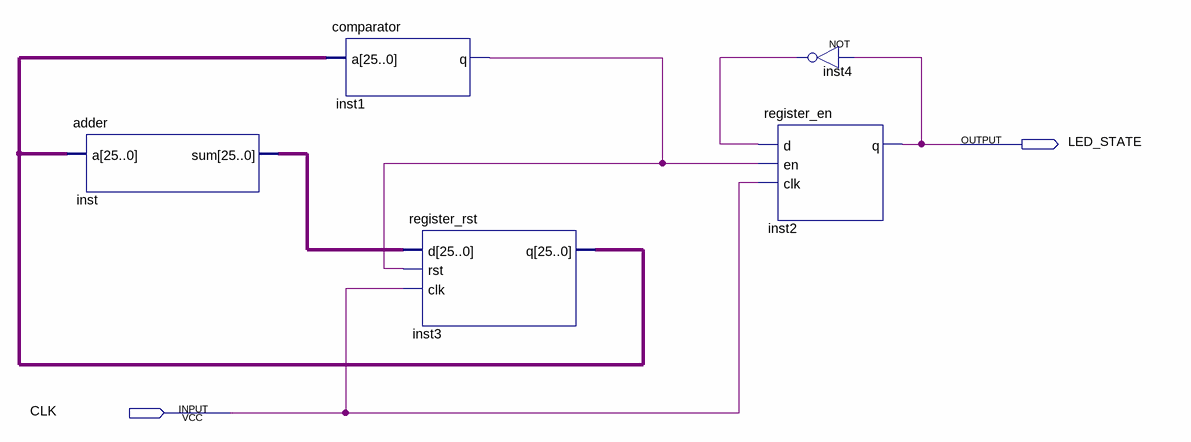
[diagram p0: schematic sheet]
// Quartus schematic full_circuit.bdf as structural Verilog: 5 symbols, 2 pins
module full_circuit (
  input  CLK,
  output LED_STATE
);

  wire inst1_q, inst4_out;
  wire [25:0] inst3_q, inst_sum;

  adder inst (.a(inst3_q), .sum(inst_sum));
  comparator inst1 (.a(inst3_q), .q(inst1_q));
  register_rst inst3 (.d(inst_sum), .rst(inst1_q), .clk(CLK), .q(inst3_q));
  register_en inst2 (.d(inst4_out), .en(inst1_q), .clk(CLK), .q(LED_STATE));
  not inst4 (inst4_out, LED_STATE);
endmodule
